# EAGLE design H2BR0-6 (EAGLE 9.6.1)

## Sheet 1 of 2
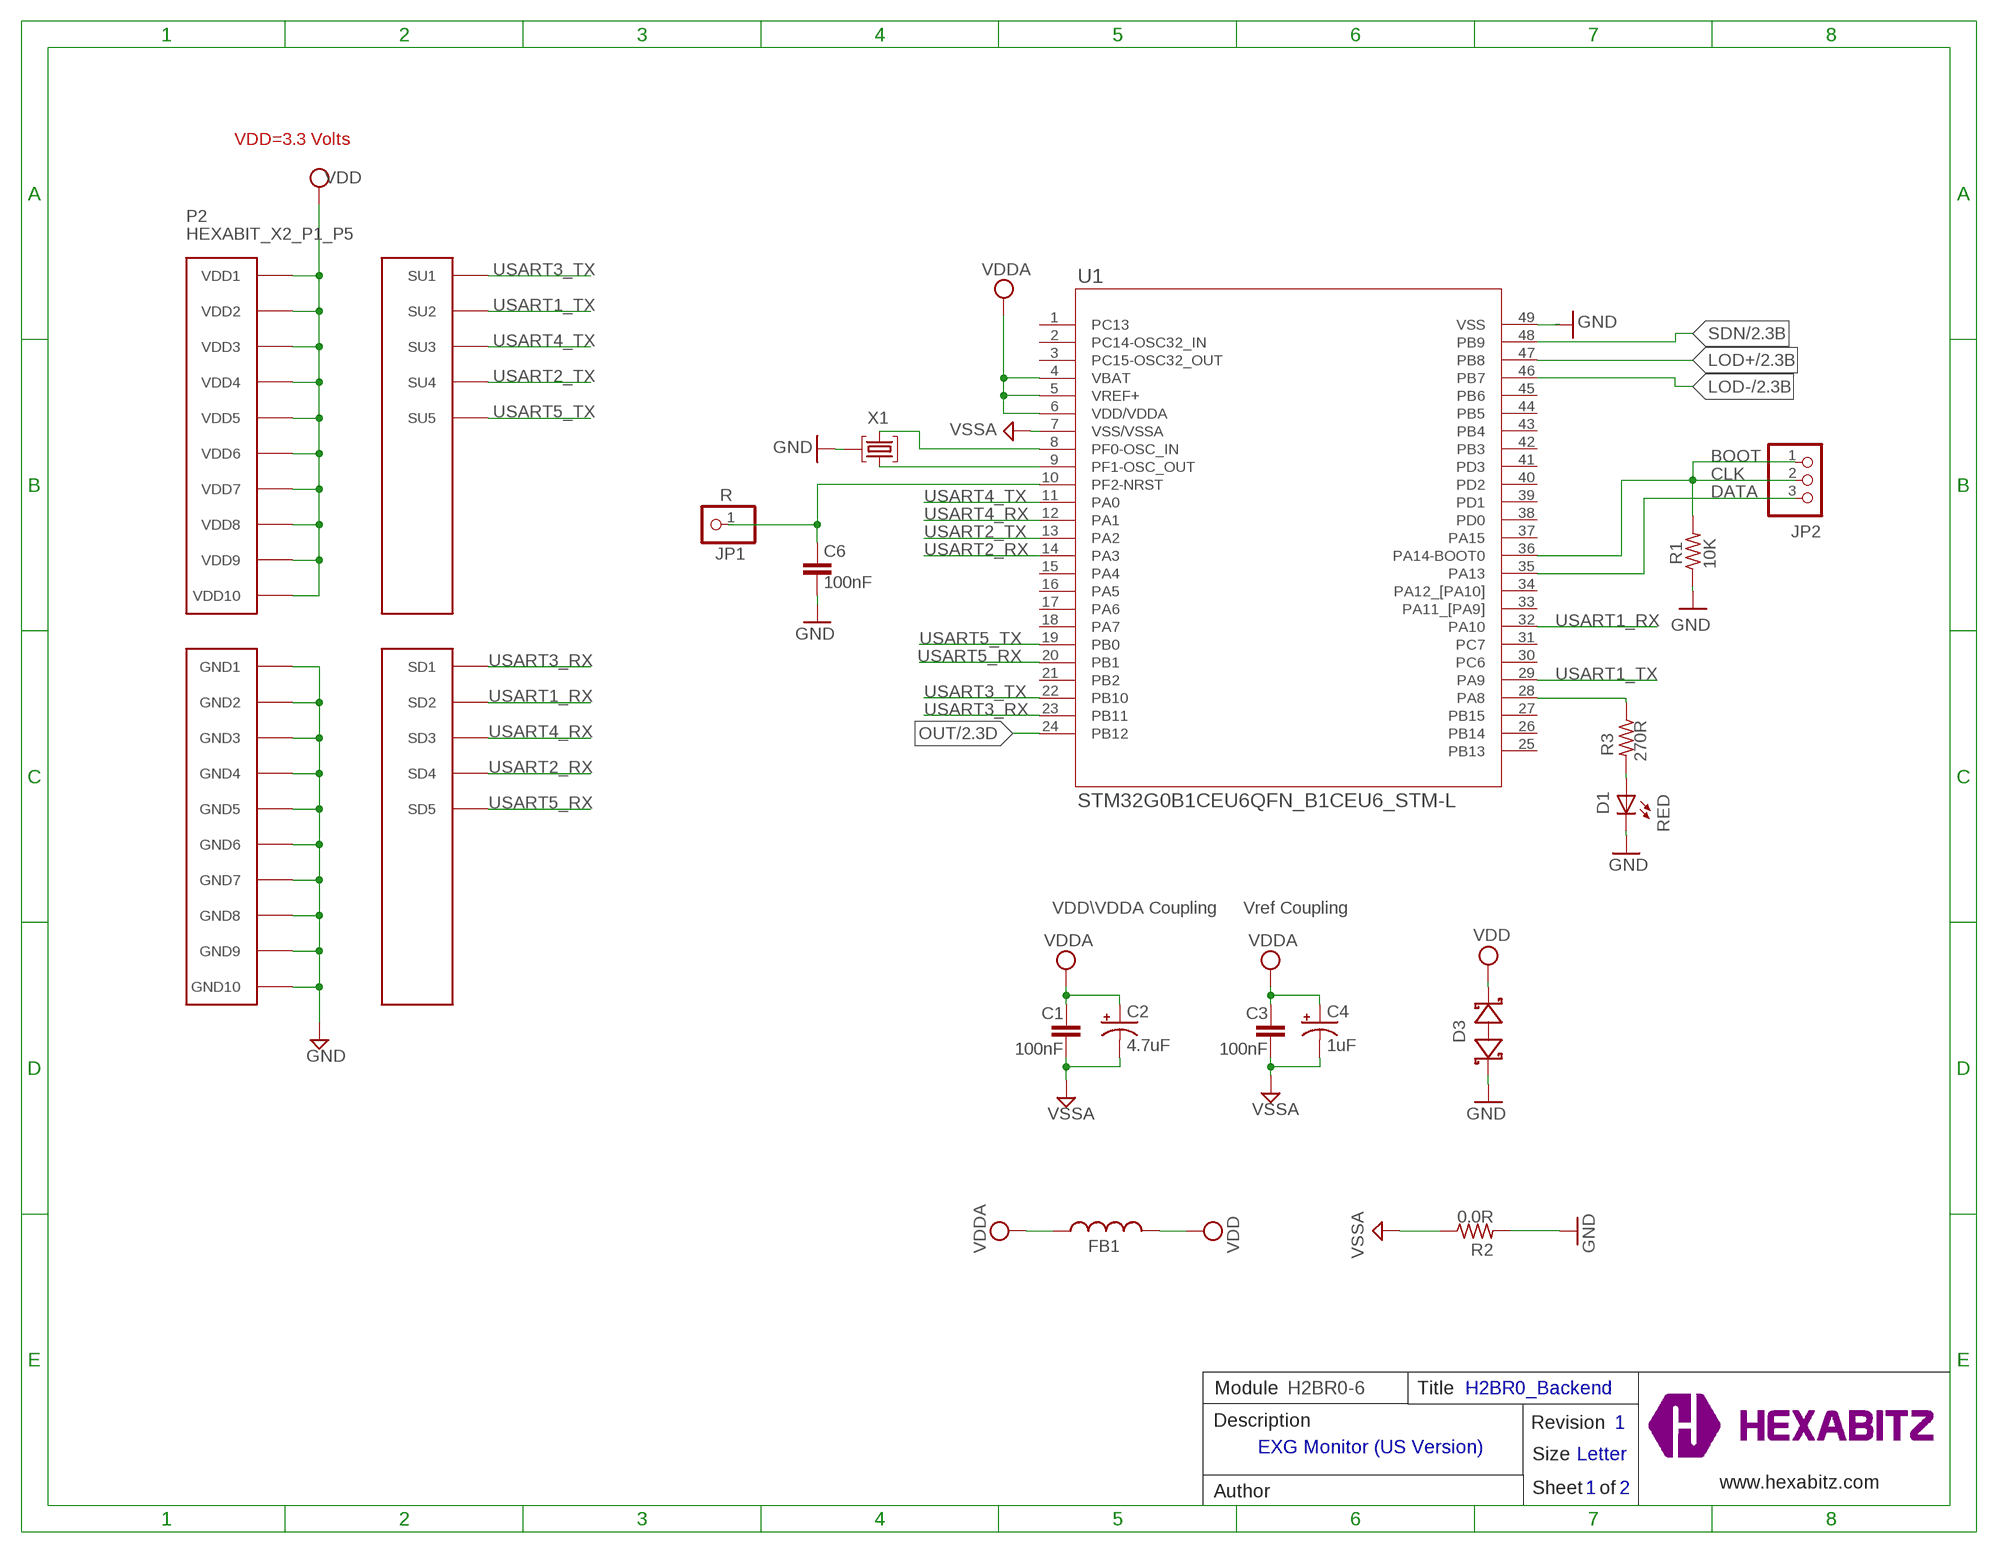
[diagram p0: schematic, sheet 1]

### Parts
C1  100nF  C-0603  [C-0603]
C2  4.7uF  C-0805-POL  [C-0805-POL]
C3  100nF  C-0603  [C-0603]
C4  1uF  C-0805-POL  [C-0805-POL]
C6  100nF  C-0603  [C-0603]
D1  RED  VLMS1300-GS08  [VLMS1300-GS08]
D3  BOURNS_CDSOD323-T03SCBOURNS_CDSOD323-T03SC_0_0  [BOURNS_CDSOD323-T03SC_0]
FB1  FB-0603  [FB-0603]
JP1  R  PINHD-1X1  [1X01]
JP2  PINHD-1X3  [1X03]
P2  HEXABIT_X2_P1_P5  [HEXABIT_17.32_X2_P1_P5]
R1  10K  R-0603  [R-0603]
R2  0.0R  R-0603  [R-0603]
R3  270R  R-0603  [R-0603]
TRIMBLE-LOGO2  HEXA-LOGO  [HEXA-LOGO]
U1  STM32G0B1CEU6QFN_B1CEU6_STM-L  [QFN_B1CEU6_STM-L]
X1  XTALL_CSTCE8M00G52  [XTALL_CSTCE8M00G52]

### Nets
CLK: JP2.1 JP2.2 R1.2 U1.36(PA14-BOOT0)
DATA: JP2.3 U1.35(PA13)
GND: C6.2 D1.C D3.1(A) P2.PAD_PD11(GND1) P2.PAD_PD12(GND2) P2.PAD_PD13(GND3) P2.PAD_PD14(GND4) P2.PAD_PD15(GND5) P2.PAD_PD16(GND6) P2.PAD_PD17(GND7) P2.PAD_PD18(GND8) P2.PAD_PD19(GND9) P2.PAD_PD20(GND10) R1.1 R2.2 U1.49(VSS) X1.P$2
LOD+: U1.47(PB8) ; also sheet 2
LOD-: U1.46(PB7) ; also sheet 2
N$1: D1.A R3.2
N$2: R3.1 U1.28(PA8)
N$5: U1.9(PF1-OSC_OUT) X1.P$1
N$6: U1.8(PF0-OSC_IN) X1.P$3
N$8: C6.1 JP1.1 U1.10(PF2-NRST)
OUT: U1.24(PB12) ; also sheet 2
SDN: U1.48(PB9) ; also sheet 2
USART1_RX: P2.PAD_PD2(SD2) U1.32(PA10)
USART1_TX: P2.PAD_PU2(SU2) U1.29(PA9)
USART2_RX: P2.PAD_PD4(SD4) U1.14(PA3)
USART2_TX: P2.PAD_PU4(SU4) U1.13(PA2)
USART3_RX: P2.PAD_PD1(SD1) U1.23(PB11)
USART3_TX: P2.PAD_PU1(SU1) U1.22(PB10)
USART4_RX: P2.PAD_PD3(SD3) U1.12(PA1)
USART4_TX: P2.PAD_PU3(SU3) U1.11(PA0)
USART5_RX: P2.PAD_PD5(SD5) U1.20(PB1)
USART5_TX: P2.PAD_PU5(SU5) U1.19(PB0)
VDD: D3.2(C) FB1.2 P2.PAD_PU11(VDD1) P2.PAD_PU12(VDD2) P2.PAD_PU13(VDD3) P2.PAD_PU14(VDD4) P2.PAD_PU15(VDD5) P2.PAD_PU16(VDD6) P2.PAD_PU17(VDD7) P2.PAD_PU18(VDD8) P2.PAD_PU19(VDD9) P2.PAD_PU20(VDD10) ; also sheet 2
VDDA: C1.1 C2.1(+) C3.1 C4.1(+) FB1.1 U1.4(VBAT) U1.5(VREF+) U1.6(VDD/VDDA) ; also sheet 2
VSSA: C1.2 C2.2(-) C3.2 C4.2(-) R2.1 U1.7(VSS/VSSA) ; also sheet 2
Unconnected: U1.1(PC13) U1.2(PC14-OSC32_IN) U1.3(PC15-OSC32_OUT) U1.15(PA4) U1.16(PA5) U1.17(PA6) U1.18(PA7) U1.21(PB2) U1.25(PB13) U1.26(PB14) U1.27(PB15) U1.30(PC6) U1.31(PC7) U1.33(PA11_[PA9]) U1.34(PA12_[PA10]) U1.37(PA15) U1.38(PD0) U1.39(PD1) U1.40(PD2) U1.41(PD3) U1.42(PB3) U1.43(PB4) U1.44(PB5) U1.45(PB6)

### Notes on the sheet
- VDD=3.3 Volts
- BOOT
- VDD\VDDA Coupling | Vref Coupling
- Module | H2BR0-6 | Title | H2BR0_Backend
- Description | Revision | 1
- EXG Monitor (US Version)
- Size | Letter
- www.hexabitz.com
- Author | Sheet   of | 1 | 2
- C:/Users/Admin/Desktop/logodraft.bmp

## Sheet 2 of 2
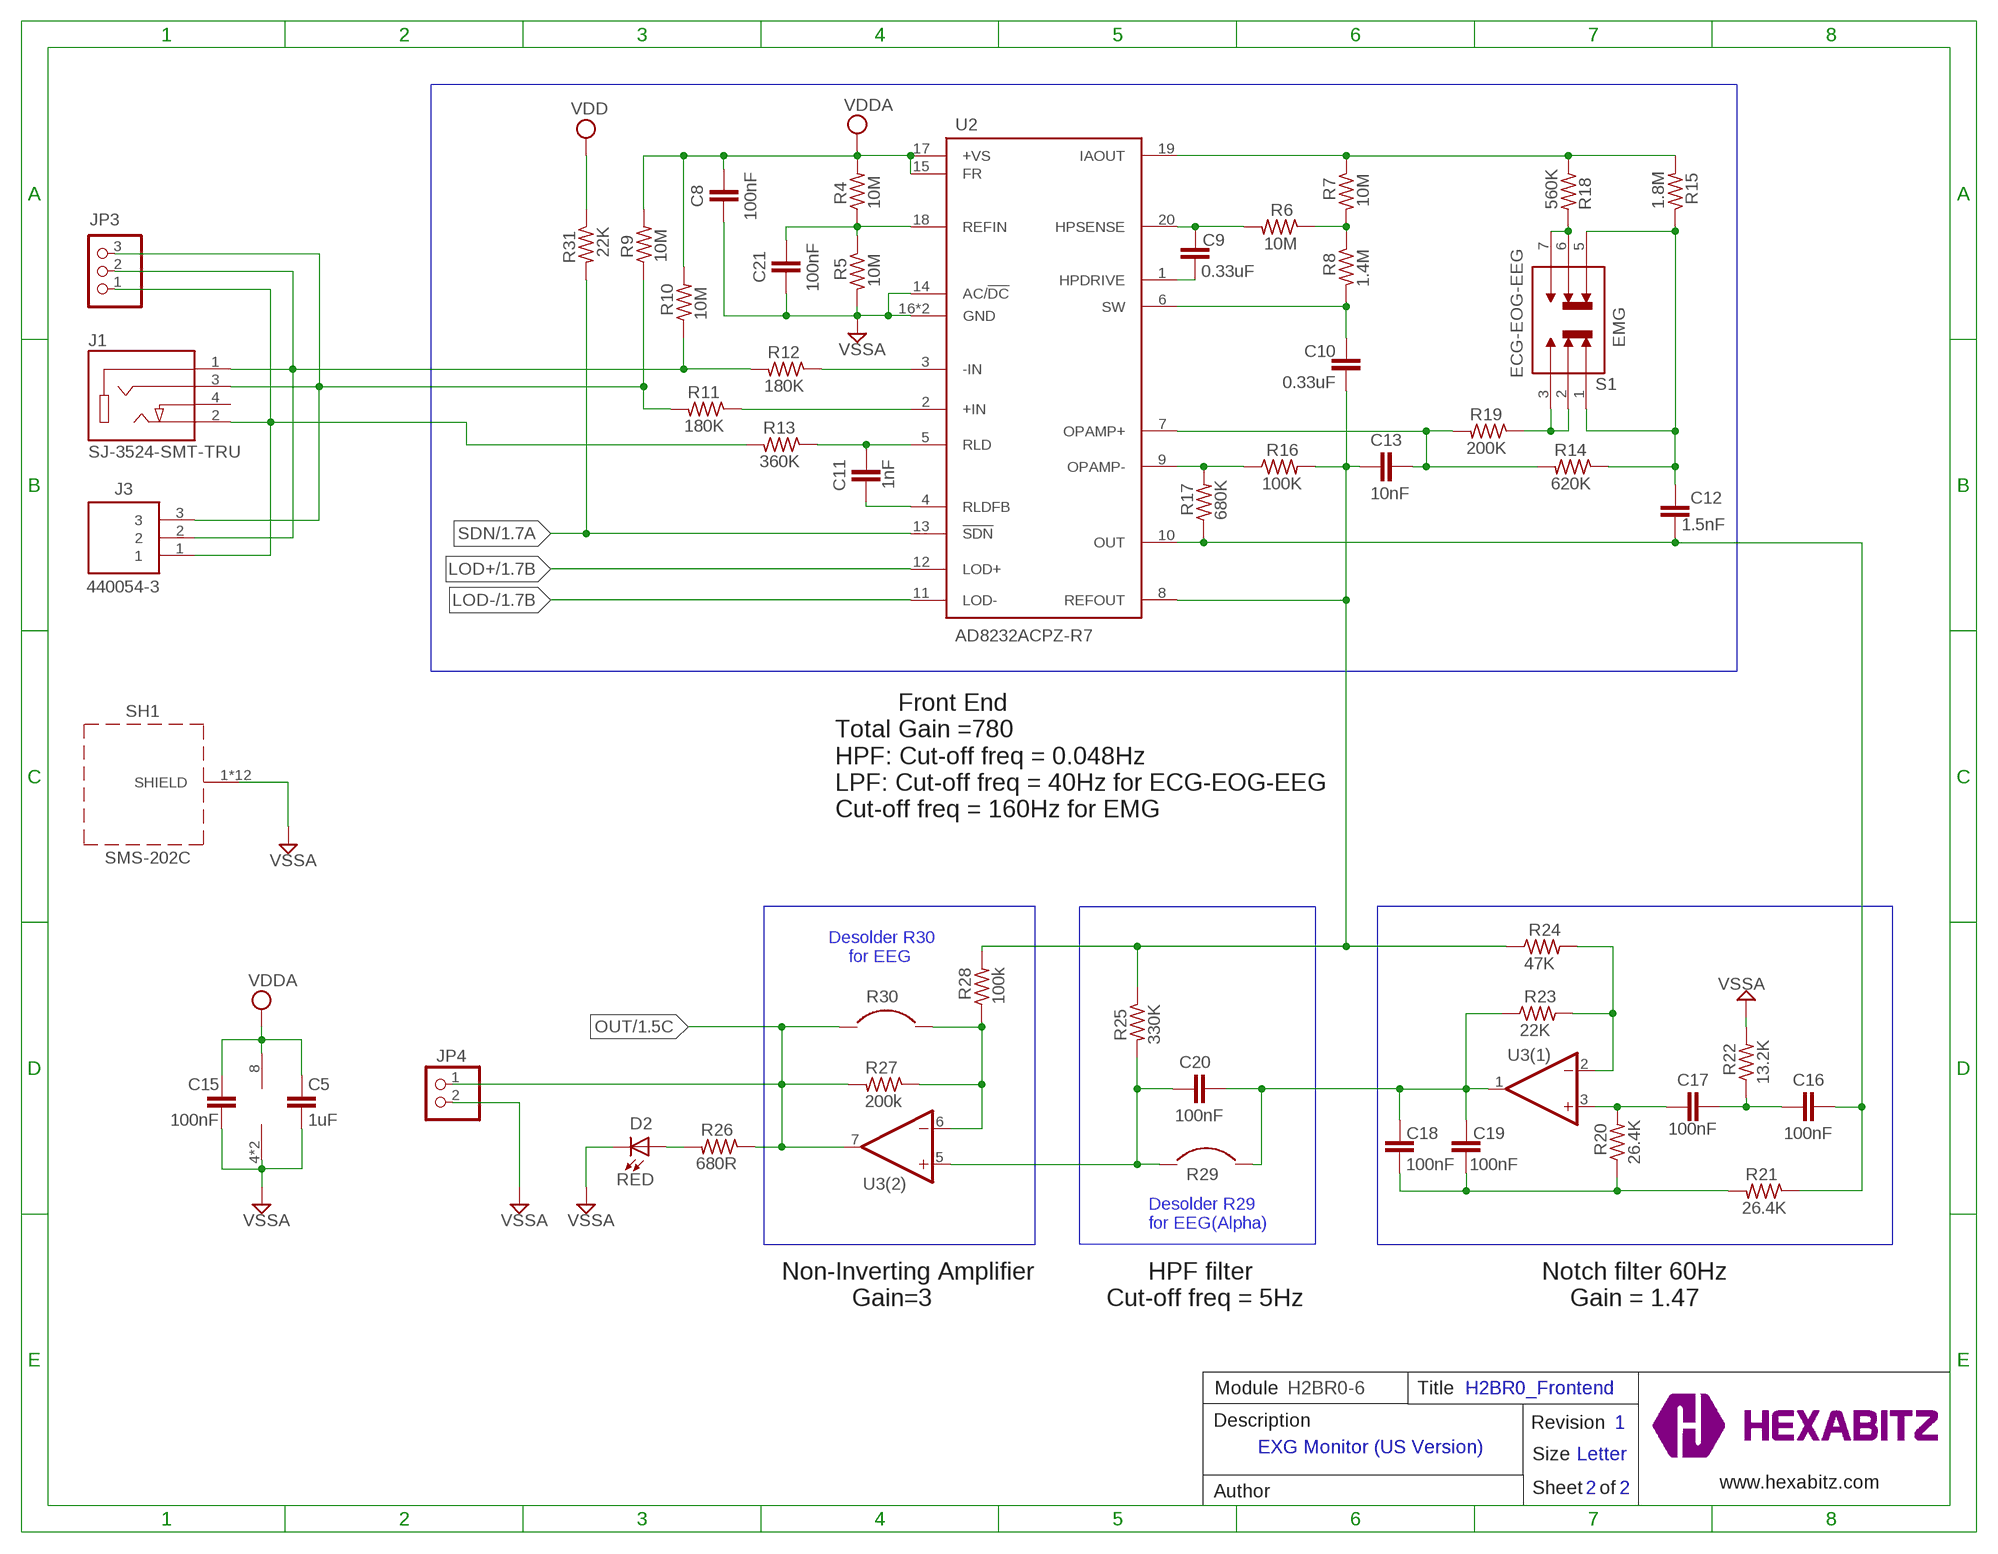
[diagram p1: schematic, sheet 2]

### Parts
C5  1uF  C-0402  [C-0402]
C8  100nF  C-0402  [C-0402]
C9  0.33uF  C-0402  [C-0402]
C10  0.33uF  C-0402  [C-0402]
C11  1nF  C-0402  [C-0402]
C12  1.5nF  C-0402  [C-0402]
C13  10nF  C-0402  [C-0402]
C15  100nF  C-0402  [C-0402]
C16  100nF  C-0402  [C-0402]
C17  100nF  C-0402  [C-0402]
C18  100nF  C-0402  [C-0402]
C19  100nF  C-0402  [C-0402]
C20  100nF  C-0402  [C-0402]
C21  100nF  C-0402  [C-0402]
D2  RED  VLMS1300-GS08  [VLMS1300-GS08]
J1  SJ-3524-SMT-TRU  [CUI_SJ-3524-SMT]
J3  440054-3  [SHDR3W50P0X200_1X3_800X470X635]
JP3  PINHD-1X3  [1X03]
JP4  PINHD-1X2(ROUND)  [1X02]
R4  10M  R-0402  [R-0402]
R5  10M  R-0402  [R-0402]
R6  10M  R-0402  [R-0402]
R7  10M  R-0402  [R-0402]
R8  1.4M  R-0402  [R-0402]
R9  10M  R-0402  [R-0402]
R10  10M  R-0402  [R-0402]
R11  180K  R-0402  [R-0402]
R12  180K  R-0402  [R-0402]
R13  360K  R-0402  [R-0402]
R14  620K  R-0402  [R-0402]
R15  1.8M  R-0402  [R-0402]
R16  100K  R-0402  [R-0402]
R17  680K  R-0402  [R-0402]
R18  560K  R-0402  [R-0402]
R19  200K  R-0402  [R-0402]
R20  26.4K  R-0402  [R-0402]
R21  26.4K  R-0402  [R-0402]
R22  13.2K  R-0402  [R-0402]
R23  22K  R-0402  [R-0402]
R24  47K  R-0402  [R-0402]
R25  330K  R-0402  [R-0402]
R26  680R  R-0603  [R-0603]
R27  200k  R-0402  [R-0402]
R28  100k  R-0402  [R-0402]
R29  SB-0603  [SB-0603]
R30  SB-0603  [SB-0603]
R31  22K  R-0402  [R-0402]
S1  JS202011JCQN  [SW_JS202011JCQN]
SH1  SMS-202C  [SMS202F]
U2  AD8232ACPZ-R7  [QFN50P400X400X80-21N]
U3  TSV772IQ2T_SEPARATED_SYMBOLSSON50P200X200X60-9N  [SON50P200X200X60-9N]

### Nets
IN+: J1.3 J3.3 JP3.3 R9.1 R11.2
IN-: J1.1 J3.2 JP3.2 R10.1 R12.2
LOD+: U2.12(LOD+) ; also sheet 1
LOD-: U2.11(LOD-) ; also sheet 1
N$3: R16.1 R17.2 U2.9(OPAMP-)
N$4: C12.1 C16.2 R17.1 R21.1 U2.10(OUT)
N$7: C13.1 R14.2 R19.2 U2.7(OPAMP+)
N$9: R27.1 R28.1 R30.2 U3.6((2):-IN)
N$10: R19.1 S1.2 S1.3
N$11: R18.2 S1.6 S1.7
N$12: C12.2 R14.1 R15.1 S1.1 S1.5
N$13: R7.1 R15.2 R18.1 U2.19(IAOUT)
N$14: C9.1 R6.2 U2.20(HPSENSE)
N$15: C9.2 U2.1(HPDRIVE)
N$16: R6.1 R7.2 R8.1
N$17: R23.2 R24.2 U3.2((1):-IN)
N$18: C21.1 R4.1 R5.1 U2.18(REFIN)
N$19: C18.1 C19.1 R20.1 R21.2
N$20: C11.1 R13.1 U2.5(RLD)
N$21: C17.1 R20.2 U3.3((1):+IN)
N$22: C18.2 C19.2 C20.2 R23.1 R29.2 U3.1((1):OUT)
N$23: C16.1 C17.2 R22.1
N$24: C20.1 R25.2 R29.1 U3.5((2):+IN)
N$25: C10.2 C13.2 R16.2 R24.1 R25.1 R28.2 U2.8(REFOUT)
N$26: C10.1 R8.2 U2.6(SW)
N$27: D2.A R26.2
N$29: C11.2 U2.4(RLDFB)
N$30: R12.1 U2.3(-IN)
N$31: R11.1 U2.2(+IN)
OUT: JP4.1 R26.1 R27.2 R30.1 U3.7((2):OUT) ; also sheet 1
REF: J1.2 J3.1 JP3.1 R13.2
SDN: R31.2 U2.13(!SDN) ; also sheet 1
VDD: R31.1 ; also sheet 1
VDDA: C5.1 C8.1 C15.1 R4.2 R9.2 R10.2 U2.15(FR) U2.17(+VS) U3.8(P:V+) ; also sheet 1
VSSA: C5.2 C8.2 C15.2 C21.2 D2.C JP4.2 R5.2 R22.2 SH1.1(SHIELD) SH1.2(SHIELD) SH1.3(SHIELD) SH1.4(SHIELD) SH1.5(SHIELD) SH1.6(SHIELD) SH1.7(SHIELD) SH1.8(SHIELD) SH1.9(SHIELD) SH1.10(SHIELD) SH1.11(SHIELD) SH1.12(SHIELD) U2.14(AC/!DC) U2.16(GND) U2.21(GND) U3.4(P:V-) U3.9(P:V-) ; also sheet 1
Unconnected: J1.4

### Notes on the sheet
- EMG
- ECG-EOG-EEG
- Front End
  Total Gain =780
  HPF: Cut-off freq = 0.048Hz
  LPF: Cut-off freq = 40Hz for ECG-EOG-EEG 
  Cut-off freq = 160Hz for EMG
- Desolder R30
      for EEG
- Desolder R29 
  for EEG(Alpha)
- Non-Inverting Amplifier
            Gain=3
- HPF filter
  Cut-off freq = 5Hz
- Notch filter 60Hz
      Gain = 1.47
- Module | H2BR0-6 | Title | H2BR0_Frontend
- Description | Revision | 1
- EXG Monitor (US Version)
- Size | Letter
- www.hexabitz.com
- Author | Sheet   of | 2 | 2
- C:/Users/Admin/Desktop/logodraft.bmp

## Library data of the parts
C1 C3 C6 = HEXABITZ_RCLS:C-0603: CAP CER 10% X7R 0603
C2 C4 = HEXABITZ_RCLS:C-0805-POL: Cap Tant Solid SMD 2012
C5 C8-C13 C15-C19 C21 = HEXABITZ_RCLS:C-0402: CAP CER 10% 0402
C20 = HEXABITZ_RCLS:C-0402: CAP CER 10% 0402; MPN: GRM188R61A105KA61J
D1 D2 = Hexabitz:VLMS1300-GS08: Red 0603 130° Clear 54 mcd 2 V Surface Mount ChipLED ; Octopart Url : http://octopart.com/vlms1300-gs08-vishay-21709201; MFN: Vishay; MPN: VLMS1300-GS08; OCTOPART_URL: https://octopart.com/vlms1300-gs08-vishay-21709201?r=sp&s=_gcP4_q8T1SC6PJQPTQ9yA
D3 = HEXABITZ_RCLS:BOURNS_CDSOD323-T03SC: CDSOD323-TxxSC - TVS Diode Series; DESCRIPTION: Dio Tvs Vwm 03V 500W Bidir Sod323 / Tape & Reel - 7" Reel; MFN: Bourns; MPN: CDSOD323-T03SC; OCTOPART_URL: https://octopart.com/cdsod323-t03sc-bourns-10487153?r=sp
FB1 = HEXABITZ_RCLS:FB-0603: Ferrite Beads Multi-Layer 0603
J1 = HEXABITZ_ICs:SJ-3524-SMT-TR: https://octopart.com/search?q=SJ-3524-SMT-TR&currency=USD&specs=0; AVAILABILITY: In Stock; DESCRIPTION: CONN JACK STEREO 3.5MM SMD R/A; MNF: CUI Devices; MPN: SJ-3524-SMT-TR; OCTOPART_URL: https://octopart.com/search?q=SJ-3524-SMT-TR&currency=USD&specs=0; PRICE: 1.03
J3 = HEXABITZ_CONNECTION_PARTS:440054-3: Body Features: Primary Product Color Natural | Configuration Features: Number of Positions 3 | Number of Rows 1 | PCB Mount Orientation Vertical | Contact Features: PCB Contact Termination Area Plating Material Tin | Contact Mating Area Plating Material Thickness 2.032 MICM | Contact Type Pin | Contact Current Rating (Max) 3 AMP | Contact Mating Area Plating Material Finish Bright | Mating Square Post Dimension .5 MM | Contact Mating Area Plating Material Thickness 80 MICIN | Contact Base Material Brass | M Source: Datasheet <https://www.te.com/commerce/DocumentDelivery/DDEController?Action=srchrtrv&DocNm=1-1773713-2_HPI_QRG_EN&DocType=Data Sheet&DocLang=English&PartCntxt=440054-3&DocFormat=pdf>; ARROW_PART_NUMBER: 440054-3; ARROW_PRICE-STOCK: https://www.arrow.com/en/products/440054-3/te-connectivity?region=nac; DESCRIPTION: Body Features: Primary Product Color Natural | Configuration Features: Number of Positions 3 | Number of Rows 1 | PCB Mount Orientation Vertical | Contact Features: PCB Contact Termination Area Plating Material Tin | Contact Mating Area Plating Material Thickness 2.032 MICM | Contact Type Pin | Contact Current Rating (Max) 3 AMP | Contact Mating Area Plating Material Finish Bright | Mating Square Post Dimension .5 MM | Contact Mating Area Plating Material Thickness 80 MICIN | Contact Base Material Brass | M; HEIGHT: 6.35mm; MANUFACTURER_NAME: TE Connectivity; MANUFACTURER_PART_NUMBER: 440054-3; MOUSER_PART_NUMBER: 571-440054-3; MOUSER_PRICE-STOCK: https://www.mouser.co.uk/ProductDetail/TE-Connectivity/440054-3?qs=JFPmFzpscO5ATC%252BmN3ka1Q%3D%3D
JP1 = HEXABITZ_USER_INTERFACE_PARTS:PINHD-1X1: PIN HEADER; MFN: TE Connectivity; MPN: 87227-1; OCTOPART_URL: https://octopart.com/87227-1-te+connectivity-39512052?r=sp
JP2 JP3 = pinhead:PINHD-1X3: PIN HEADER
JP4 = pinhead:PINHD-1X2(ROUND): PIN HEADER
P2 = hexabitz_connectors:HEXABIT_X2_P1_P5
R1-R3 R26 = HEXABITZ_RCLS:R-0603: Thick Film Resistors - SMD 0603
R4-R25 R27 R28 R31 = HEXABITZ_RCLS:R-0402: Thick Film Resistors - SMD 0603
R29 R30 = HEXABITZ_RCLS:SB-0603: Thick Film Resistors - SMD 0603
S1 = HEXABITZ_OTHER_PARTS:JS202011JCQN: Slide Switch DPDT Surface Mount Check availability <https://pricing.snapeda.com/parts/JS202011JCQN/C%26K/view-part?ref=eda>; AVAILABILITY: In Stock; CHECK_PRICES: https://www.snapeda.com/parts/JS202011JCQN/C%2526K/view-part/?ref=eda; DESCRIPTION: Slide Switch DPDT Surface Mount; MF: C&K; MP: JS202011JCQN; PACKAGE: DPDT-6 C&amp;K; PRICE: None; SNAPEDA_LINK: https://www.snapeda.com/parts/JS202011JCQN/C%2526K/view-part/?ref=snap
SH1 = HEXABITZ_OTHER_PARTS:SMS-202C: LEADER TECH-FERRISHIELD - SMS-202C - EMI SHIELDING, 17.07 X 17.07 X 2.01MM Source: Datasheet <https://www.leadertechinc.com/assets/files/EngineeringDrawings/SMS-202.pdf>; DESCRIPTION: LEADER TECH-FERRISHIELD - SMS-202C - EMI SHIELDING, 17.07 X 17.07 X 2.01MM; HEIGHT: 3.61mm; MANUFACTURER_NAME: Leader Tech Inc.; MANUFACTURER_PART_NUMBER: SMS-202C; MOUSER_PART_NUMBER: 861-SMS-202C; MOUSER_PRICE-STOCK: https://www.mouser.co.uk/ProductDetail/LeaderTech/SMS-202C?qs=u16ybLDytRYoSSFRGBpM2A%3D%3D
TRIMBLE-LOGO2 = HEXABITZ_USER_INTERFACE_PARTS:HEXA-LOGO: Trimble-Logo
U1 = HEXABITZ_ICs:STM32G0B1CEU6; COPYRIGHT: Copyright (C) 2021 Ultra Librarian. All rights reserved.; MANUFACTURER_PART_NUMBER: STM32G0B1CEU6; MFR_NAME: STMicroelectronics
U2 = HEXABITZ_ICs:AD8232ACPZ-R7: ANALOG DEVICES - AD8232ACPZ-R7 - SIGNAL CONDITIONER, ECG, LFCSP-20 Source: Datasheet <https://www.analog.com/media/jp/technical-documentation/data-sheets/AD8232_jp.pdf>; ARROW_PART_NUMBER: AD8232ACPZ-R7; ARROW_PRICE-STOCK: https://www.arrow.com/en/products/ad8232acpz-r7/analog-devices?region=nac; DESCRIPTION: ANALOG DEVICES - AD8232ACPZ-R7 - SIGNAL CONDITIONER, ECG, LFCSP-20; HEIGHT: 0.8mm; MANUFACTURER_NAME: Analog Devices; MANUFACTURER_PART_NUMBER: AD8232ACPZ-R7; MOUSER_PART_NUMBER: 584-AD8232ACPZ-R7; MOUSER_PRICE-STOCK: https://www.mouser.co.uk/ProductDetail/Analog-Devices/AD8232ACPZ-R7?qs=%2FtpEQrCGXCwf%2FvQng%2FSFzg%3D%3D
U3 = HEXABITZ_ICs:TSV772IQ2T_SEPARATED_SYMBOLS: OP AMP also LM158; LM258; LM2904 Source: http://cache.national.com/ds/LM/LM158.pdf
X1 = Hexabitz:XTALL_CSTCE8M00G52: MURATA CSTCE8M00G52-R0 RESONATOR, SMD, 8MHZ ; Octopart Url : https://octopart.com/cstce8m00g52-r0-murata-7145559; MFN: Murata; MPN: CSTCE8M00G52Z-R0; OCTOPART_URL: https://octopart.com/cstce8m00g52z-r0-murata-17755941?r=sp&s=JDnNJnrHQhyS8Zk4ofFWXw

## Board
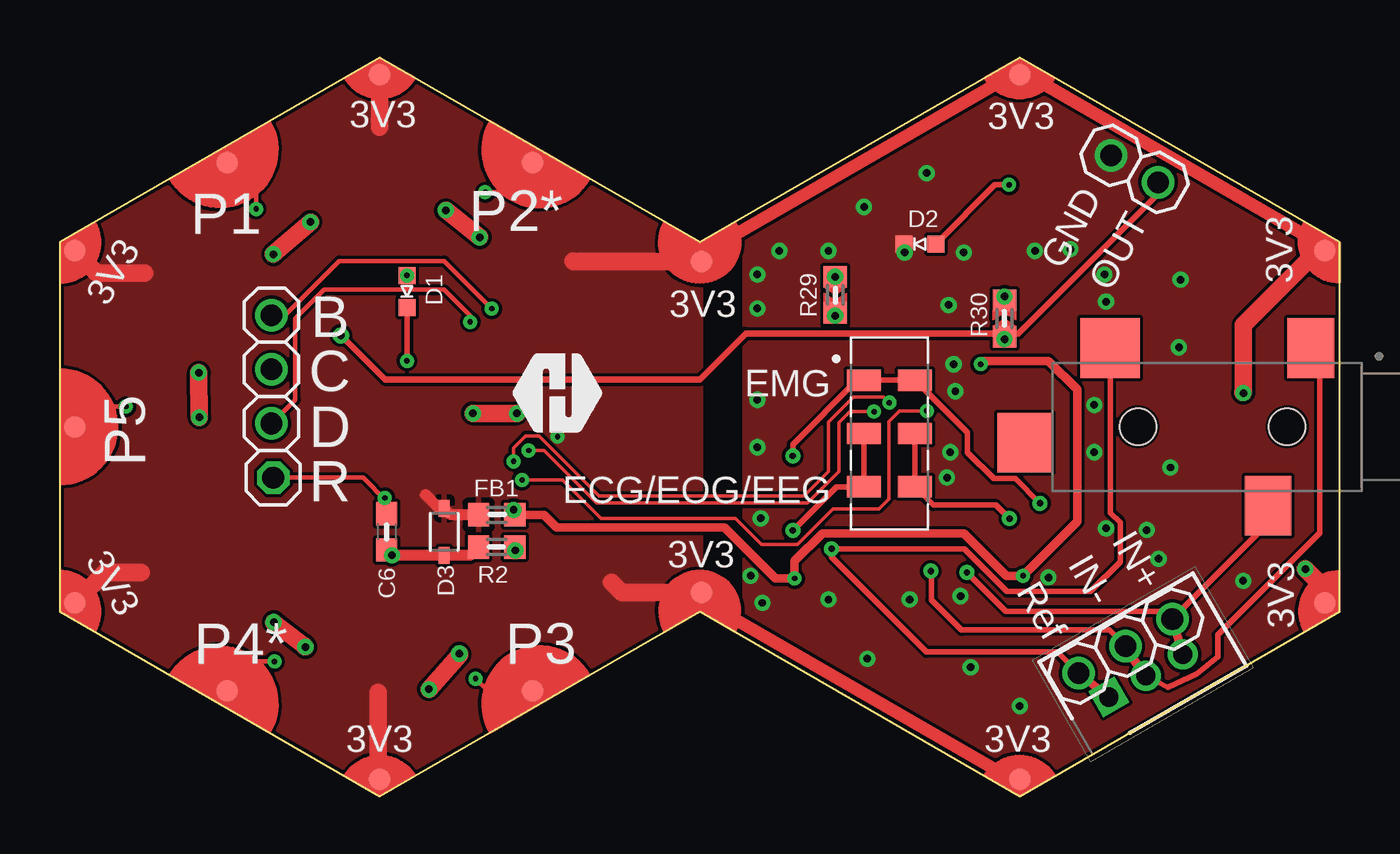
[diagram p2: board, top side]
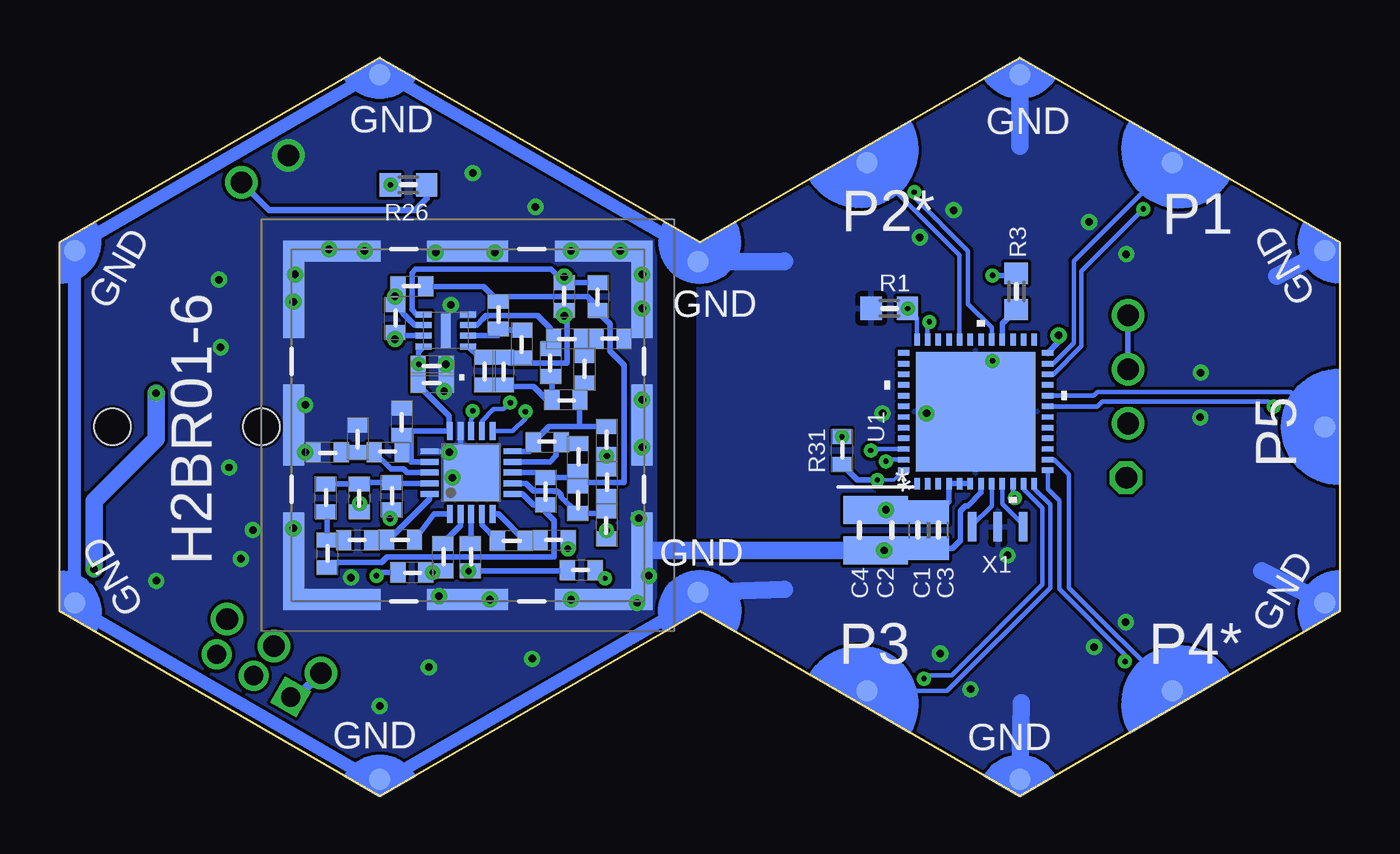
[diagram p3: board, bottom side, seen from below]

Size 60 x 34.64 mm. Coordinates in mm from the lower left corner, seen from the top.
Copper layers (1*16): Top 0.035mm / dielectric 1.5mm / Bottom 0.035mm
Design rules "default *": minimum track width 6mil, minimum drill 0.25mm, track to track 6mil, track to pad 6mil, pad to pad 6mil, via to via 6mil, smd to smd 0mil, copper to edge 0.15mm, drill to drill 6mil, minimum pad ring 10mil, minimum via ring 8mil, stop-mask expansion 4mil, vias tented up to drill 24mil, thermal gap 10mil

### Footprints (pad centres in the part's own frame; a part is rotated, then mirrored left to right if it is on the bottom)
C-0603 = smd 1.1 x 1: 1 -0.85,0; 2 0.85,0
C-0805-POL = smd 1.3 x 1.5: 1 -0.95,0; 2 0.95,0
C-0402 = smd 0.7 x 0.9: 1 -0.65,0; 2 0.65,0
VLMS1300-GS08 = smd 0.8 x 0.8: A 0,0.75; C 0,-0.75
BOURNS_CDSOD323-T03SC_0 = smd 0.8 x 0.5: 1 -1.1,0; 2 1.1,0
FB-0603 = smd 1 x 1.1: 1 -0.85,0; 2 0.85,0
CUI_SJ-3524-SMT = smd 2.2 x 2.8: 1 -1.1,-3.7; 3 0.9,3.7 | smd 2.8 x 2.8: 2 8.3,-3.7 | smd 2.6 x 2.8: 4 12.3,0.75 | hole 1.7: 0,0; 7,0
SHDR3W50P0X200_1X3_800X470X635 = drill 0.9 pad 1.35 square: 1 0,0 | drill 0.9 pad 1.35: 2 2,0; 3 4,0
1X01 = drill 1.016 octagon: 1 0,0
1X03 = drill 1.016: 1 -2.54,0; 2 0,0; 3 2.54,0
1X02 = drill 1.016: 1 -1.27,0; 2 1.27,0
HEXABIT_17.32_X2_P1_P5 = smd 1 x 1 bottom: PAD_PD1 12.39,22.39; PAD_PD2 12.39,8.09; PAD_PD3 -12.39,8.09; PAD_PD4 -12.39,22.39; PAD_PD5 0,29.55; PAD_PD12 16.52,15.24; PAD_PD13 7.752,0.168; PAD_PD14 16.52,-14.76; PAD_PD15 8.26,-29.07; PAD_PD16 -8.26,-29.07; PAD_PD17 -16.52,-14.76; PAD_PD18 -7.752,0.168; PAD_PD19 -16.52,15.24 | smd 1 x 1 rotated 60 bottom: PAD_PD11 8.26,29.547 | smd 1 x 1 rotated 120 bottom: PAD_PD20 -8.26,29.547 | smd 1 x 1: PAD_PU1 12.39,22.39; PAD_PU2 12.39,8.09; PAD_PU3 -12.39,8.09; PAD_PU4 -12.39,22.39; PAD_PU5 0,29.55; PAD_PU12 16.52,15.24; PAD_PU13 7.752,0.168; PAD_PU14 16.52,-14.76; PAD_PU15 8.26,-29.07; PAD_PU16 -8.26,-29.07; PAD_PU17 -16.52,-14.76; PAD_PU18 -7.752,0.168; PAD_PU19 -16.52,15.24 | smd 1 x 1 rotated 60: PAD_PU11 8.26,29.547 | smd 1 x 1 rotated 120: PAD_PU20 -8.26,29.547
R-0603 = smd 1 x 1.1: 1 -0.85,0; 2 0.85,0
R-0402 = smd 0.7 x 0.9: 1 -0.65,0; 2 0.65,0
SB-0603 = smd 1 x 1.1: 1 -0.85,0; 2 0.85,0
SW_JS202011JCQN = smd 1.6 x 1: 1 -1.2,2.5; 2 -1.2,0; 3 -1.2,-2.5; 5 1.2,2.5; 6 1.2,0; 7 1.2,-2.5
SMS202F = smd 0.99 x 3.58: 1 -8.165,5.88; 3 -8.165,-5.88; 7 8.165,-5.88; 9 8.165,5.88 | smd 0.99 x 3.81: 2 -8.165,0.01; 8 8.165,0.01 | smd 4.57 x 0.99: 4 -6.375,-8.165; 6 6.375,-8.165; 10 6.375,8.165; 12 -6.375,8.165 | smd 3.81 x 0.99: 5 -0.01,-8.165; 11 -0.01,8.165
QFN_B1CEU6_STM-L = smd 0.55 x 0.254: 1 -3.38,2.751; 2 -3.38,2.251; 3 -3.38,1.75; 4 -3.38,1.25; 5 -3.38,0.75; 6 -3.38,0.25; 7 -3.38,-0.25; 8 -3.38,-0.75; 9 -3.38,-1.25; 10 -3.38,-1.75; 11 -3.38,-2.251; 12 -3.38,-2.751; 25 3.38,-2.751; 26 3.38,-2.251; 27 3.38,-1.75; 28 3.38,-1.25; 29 3.38,-0.75; 30 3.38,-0.25; 31 3.38,0.25; 32 3.38,0.75; 33 3.38,1.25; 34 3.38,1.75; 35 3.38,2.251; 36 3.38,2.751 | smd 0.254 x 0.55: 13 -2.751,-3.38; 14 -2.251,-3.38; 15 -1.75,-3.38; 16 -1.25,-3.38; 17 -0.75,-3.38; 18 -0.25,-3.38; 19 0.25,-3.38; 20 0.75,-3.38; 21 1.25,-3.38; 22 1.75,-3.38; 23 2.251,-3.38; 24 2.751,-3.38; 37 2.751,3.38; 38 2.251,3.38; 39 1.75,3.38; 40 1.25,3.38; 41 0.75,3.38; 42 0.25,3.38; 43 -0.25,3.38; 44 -0.75,3.38; 45 -1.25,3.38; 46 -1.75,3.38; 47 -2.251,3.38; 48 -2.751,3.38 | smd 5.6 x 5.6: 49 0,0
QFN50P400X400X80-21N = smd 0.84 x 0.28: 1 -1.95,1; 2 -1.95,0.5; 3 -1.95,0; 4 -1.95,-0.5; 5 -1.95,-1; 11 1.95,-1; 12 1.95,-0.5; 13 1.95,0; 14 1.95,0.5; 15 1.95,1 | smd 0.28 x 0.84: 6 -1,-1.95; 7 -0.5,-1.95; 8 0,-1.95; 9 0.5,-1.95; 10 1,-1.95; 16 1,1.95; 17 0.5,1.95; 18 0,1.95; 19 -0.5,1.95; 20 -1,1.95 | smd 2.6 x 2.6: 21 0,0
SON50P200X200X60-9N = smd 0.75 x 0.28: 1 -1.05,0.75; 2 -1.05,0.25; 3 -1.05,-0.25; 4 -1.05,-0.75; 5 1.05,-0.75; 6 1.05,-0.25; 7 1.05,0.25; 8 1.05,0.75 | smd 0.45 x 1.6: 9 0,0
XTALL_CSTCE8M00G52 = smd 1.4 x 0.4: P$1 0,1.2; P$2 0,0; P$3 0,-1.2

### Placement (x,y rotation side)
C1  19.76,12.48 270 bottom
C2  21,12.48 270 bottom
C3  18.81,12.48 270 bottom
C4  22.51,12.48 270 bottom
C5  42.54,19.38 0 bottom
C6  15.32,12.4 270 top
C8  43.97,17.56 90 bottom
C9  44.03,12.03 0 bottom
C10  37.22,14.3 90 bottom
C11  38.84,11.98 180 bottom
C12  34.37,16.68 270 bottom
C13  35.72,13.91 90 bottom
C15  42.54,20.18 0 bottom
C16  35.4,20.02 270 bottom
C17  36.19,21.45 0 bottom
C18  40.08,19.94 90 bottom
C19  39.21,19.94 90 bottom
C20  36.35,23.43 270 bottom
C21  46.04,16.76 90 bottom
D1  16.27,23.67 0 top
D2  40.32,25.89 270 top
D3  18.02,12.4 90 top
FB1  20.48,13.19 180 top
J1  57.55,17.32 180 top
J3  49.19,4.65 30 top
JP1  10,14.94 0 top
JP2  9.92,20.02 270 top
JP3  49.96,7.04 30 top
JP4  50.39,29.42 150.2 top
P2  30.24,17.32 90 top
R1  21.11,22.88 0 bottom
R2  20.48,11.68 180 top
R3  15.16,23.67 90 bottom
R4  44.61,16.13 0 bottom
R5  47.46,16.13 180 bottom
R6  46.04,12 0 bottom
R7  47.54,13.99 270 bottom
R8  47.46,11.37 270 bottom
R9  43.5,10.49 180 bottom
R10  35.56,10.59 0 bottom
R11  42.05,11.21 270 bottom
R12  40.76,11.21 270 bottom
R13  36.83,12 0 bottom
R14  34.37,14.7 270 bottom
R15  45.96,13.99 90 bottom
R16  35.72,15.89 270 bottom
R17  37.15,16.61 0 bottom
R18  44.45,14.07 270 bottom
R19  34.37,12.72 90 bottom
R20  36.99,20.34 90 bottom
R21  36.27,18.59 180 bottom
R22  34.21,21.45 0 bottom
R23  38.34,21.21 90 bottom
R24  39.45,22.56 270 bottom
R25  34.76,23.43 90 bottom
R26  43.65,28.67 180 bottom
R27  44.29,22.4 270 bottom
R28  43.5,23.91 0 bottom
R29  36.35,23.51 270 top
R30  44.29,22.4 90 top
R31  23.33,16.21 270 bottom
S1  38.89,17.01 0 top
SH1  40.88,17.4 0 bottom
TRIMBLE-LOGO2  23.33,17.05 0 top
U1  17.06,18.03 90 bottom
U2  40.72,15.18 90 bottom
U3  41.91,21.84 180 bottom
X1  16.03,12.64 270 bottom

### Tracks (layer width: path | path; a pad name or v marks a point on that pad's centre or on a via)
CLK  (via drill 0.25 pad 0.55)
  Top 0.203: JP2.1 10.56,22.56 13.1,25.1 18.02,25.1 v20.25,22.87
  Bottom 0.203: R1.2 v20.25,22.87 19.81,22.43 U1.36
  Bottom 0.254: JP2.1 JP2.2
DATA  (via drill 0.25 pad 0.55)
  Top 0.203: JP2.3 11.03,18.59 11.03,22.4 12.38,23.75 18.02,23.75 19.23,22.53 v19.23,22.24
  Bottom 0.203: v19.23,22.24 19.31,22.16 U1.35
GND  (via drill 0.25 pad 0.55, 0.35 pad 0.75)
  Top 0.254: D1.C v16.27,20.42
  Top 0.305: C6.2 v15.57,11.3
  Top 0.508: R2.2 19.24,11.3 D3.1 v15.57,11.3 | v15.57,11.3
  Top 0.813: v18.73,6.68 18.73,6.62 v17.3,5.02 | v11.51,7 11.43,7.08 v10.03,8.16 | v6.54,17.77 v6.51,19.86 | v10,25.42 v11.75,26.92 | v18.1,27.48 v19.68,26.21 | v19.37,17.96 v21.43,17.96
  Bottom 0.254: v16.27,20.42 16.27,18.83 U1.49
  Bottom 0.61: P2.PAD_PD18 30.94,8.7 44.62,0.8 P2.PAD_PD17 45.38,0.8 58.8,8.55 P2.PAD_PD16 59.31,25.4 58.82,25.89 59,25.89 P2.PAD_PD15 58.8,26.09 45.38,33.84 P2.PAD_PD14 44.62,33.84 30.94,25.94 P2.PAD_PD13
  Bottom 0.813: P2.PAD_PD13 26.03,25.07 26.03,25.1 | P2.PAD_PD12 15,30.5 | P2.PAD_PD11 2.94,24.38 | P2.PAD_PD20 3.65,10.57 | P2.PAD_PD19 14.92,4.38 | P2.PAD_PD18 26.03,9.7 | U1.49 v19.37,17.96
  pour Bottom: 30.08,7.87 30.08,35.18 13.81,35.18 -0.08,35.18 -0.08,4.62 -0.08,-0.06 27.3,-0.06 30.08,-0.06
IN+  (via drill 0.3 pad 0.6)
  Top 0.254: J1.3 56.65,12.79 JP3.3 51.8,8.67 44.35,8.67 v42.53,10.49
  Top 0.406: JP3.3 J3.3
  Bottom 0.305: v42.53,10.49 R9.1 42.11,10.49 R11.2
IN-  (via drill 0.3 pad 0.6)
  Top 0.254: JP3.2 49.2,7.79 42.27,7.79 40.85,9.21 40.85,10.54 v40.84,10.56 | 58.65,20.54 J1.1 59.07,20.6 59.07,12.34 54.29,7.56 54.29,6.53 53.3,5.74 51.95,5.12 J3.2
  Top 0.406: JP3.2 49.93,7.01 50.74,5.83 J3.2
  Bottom 0.254: R10.1 36.24,10.56 R12.2
  Bottom 0.305: R12.2 v40.84,10.56
LOD+  (via drill 0.25 pad 0.55)
  Top 0.152: v21.27,15.7 21.27,16.34 21.83,16.89 22.46,16.89 25.28,14.08 34.88,14.08 36.03,15.23 36.03,17.56 37.2,18.72 38.62,18.72 v38.89,18.45
  Bottom 0.203: U2.12 40.22,17.6 39.67,18.15 39.19,18.15 v38.89,18.45 | U1.47 21.19,15.78 v21.27,15.7
LOD-  (via drill 0.25 pad 0.55)
  Top 0.152: v21.99,16.21 22.7,16.21 25.16,13.75 35.05,13.75 36.54,15.24 36.54,17.54 37.04,18.03 v38.18,18.03
  Bottom 0.203: U2.11 38.77,17.13 38.18,17.72 v38.18,18.03 | v21.99,16.21 21.91,16.28 U1.46
N$1  (via drill 0.25 pad 0.55)
  Bottom 0.254: R3.2 15.26,24.42 D1.A
  other vias: 16.27,24.42
N$2
  Bottom 0.254: R3.1 15.81,22.16 U1.28
N$3
  Bottom 0.254: U2.9 37.03,15.68 36.73,15.97 36.73,16.37 R17.2 36.43,16.54 R16.1
N$4
  Bottom 0.254: U2.10 37.99,16.18 37.8,16.37 R17.1 37.07,17.34 36.03,17.34 | R21.1 35.62,19.15 C16.2 35.64,19.13 35.64,17.34 | 36.03,17.34 | 36.03,17.34 35.64,17.34 | 35.64,17.34 C12.1
N$5
  Bottom 0.203: X1.P$1 14.83,12.72 15.81,13.7 U1.9
N$6
  Bottom 0.203: X1.P$3 17.23,12.7 16.31,13.61 U1.8
N$7
  Bottom 0.254: U2.7 38.14,14.68 37.79,14.32 36.83,14.32 | C13.1 35.72,13.21 | 36.7,14.32 36.83,14.32 | 36.83,14.32 36.79,14.28 36.66,14.28 36.5,14.12 36.5,14.04 C13.1 | C13.1 34.48,13.26 34.38,13.36 | 34.38,13.36 R19.2 | R14.2 34.38,13.36
N$8  (via drill 0.25 pad 0.55)
  Top 0.203: v15.23,13.99 15.32,13.9 15.32,13.83 | 15.32,13.83 C6.1 | JP1.1 14.21,14.94 15.32,13.83
  Bottom 0.203: U1.10 15.31,14.07 v15.23,13.99
N$9  (via drill 0.35 pad 0.75)
  Top 0.254: R30.2 v44.29,23.43
  Bottom 0.254: R27.1 43.9,22.66 43.9,22.63 43.37,22.09 U3.6
  Bottom 0.406: R28.1 44.29,23.76 v44.29,23.43 44.21,23.35 44.21,23.13 R27.1
N$10  (via drill 0.3 pad 0.6)
  Top 0.254: v34.37,12.46 36.41,14.51 S1.3 S1.2
  Bottom 0.254: v34.37,12.46 R19.1
N$11  (via drill 0.3 pad 0.6)
  Top 0.254: S1.6 S1.7 40.95,13.65 43.89,13.65 v44.53,13.02
  Bottom 0.508: v44.53,13.02 44.45,13.1 R18.2
N$12  (via drill 0.3 pad 0.6)
  Top 0.254: v45.96,13.73 44.8,14.89 43.78,14.89 42.54,16.13 42.54,17.06 S1.5 S1.1 37.37,19.51 34.37,16.5 v34.37,15.96
  Bottom 0.254: R14.1 v34.37,15.96 C12.2
  Bottom 0.508: v45.96,13.73 R15.1
N$13
  Bottom 0.254: R7.1 R15.2 45.88,14.72 R18.1 44.41,14.68 U2.19
N$14
  Bottom 0.254: 42.68,14.14 42.67,14.14 U2.20 42.67,13.94 44.58,12.03 C9.1 44.8,12.03 44.83,12 R6.2
N$15
  Bottom 0.254: C9.2 42.45,13.23 U2.1
N$16
  Bottom 0.254: R6.1 47.45,12 R8.1 47.46,13.26 R7.2
N$17
  Bottom 0.254: U3.2 39.45,21.59 R24.2 39.4,21.86 R23.2
N$18
  Bottom 0.254: U2.18 43.71,15.18 43.88,15.35 44.47,15.35 R4.1 45.27,16.11 C21.1 46.8,16.11 R5.1
N$19
  Bottom 0.254: C19.1 39.02,19.48 | C18.1 C19.1 | C19.1 39.13,19.21 37.78,19.21 37.16,18.59 R21.2 | R21.2 36.92,18.82 | R20.1 36.92,19.62 R21.2
N$20
  Bottom 0.254: R13.1 38.05,11.84 C11.1 39.43,13.23 U2.5
N$21
  Bottom 0.254: 36.99,21.59 36.99,21.92 37.6,22.54 40.01,22.54 40.18,22.37 40.45,22.09 U3.3 | 36.99,21.59 C17.1 | R20.2 36.99,21.59
N$22  (via drill 0.35 pad 0.75)
  Top 0.254: v36.35,22.54 R29.2
  Bottom 0.152: C19.2 39.18,20.56 R23.1
  Bottom 0.254: U3.1 40.35,20.59 C18.2 C19.2 38.94,20.32 36.21,20.32 36.21,22.64 C20.2 v36.35,22.54
N$23
  Bottom 0.254: 35.4,20.89 C16.1 34.86,21.21 R22.1 C17.2 35.54,21.04 35.4,20.89
N$24  (via drill 0.35 pad 0.75)
  Bottom 0.254: U3.5 43.28,22.59 43.5,22.81 43.5,24.54 43.33,24.71 36.98,24.71 C20.1 | C20.1 R25.2 | C20.1 R29.1
  other vias: 36.35,24.36
N$25
  Bottom 0.254: 35.55,14.72 35.71,14.72 35.88,14.89 35.88,15.02 | 35.55,14.72 33.55,14.72 33.55,20.22 34.21,20.88 34.21,22.15 34.76,22.7 R25.1 34.76,22.94 35.26,23.43 39.22,23.43 R24.1 40.15,23.91 R28.2 | C13.2 35.55,14.72 | R16.2 35.72,15.18 35.88,15.02 | 35.88,15.02 35.94,14.95 C10.2 37.45,15.18 U2.8
N$26
  Bottom 0.254: U2.6 38.3,14.18 37.78,13.65 C10.1 37.23,13.34 36.83,12.94 36.83,11.23 44.65,11.23 44.92,10.96 47.23,10.96 R8.2
N$27  (via drill 0.25 pad 0.55)
  Top 0.254: D2.A 43.85,28.67 R26.2
  other vias: 44.5,28.67
N$29
  Bottom 0.254: 39.49,12.18 C11.2 40.22,12.71 U2.4
N$30
  Bottom 0.254: R12.1 40.72,11.9 U2.3
N$31
  Bottom 0.254: R11.1 41.22,12.69 U2.2
OUT  (via drill 0.35 pad 0.75)
  Top 0.254: v44.29,21.43 R30.1
  Top 0.305: v13.17,21.61 15.24,19.54 30,19.54 32.17,21.71 44.13,21.71 R30.1 44.45,21.71 44.95,21.71 51.49,28.25 JP4.1
  Bottom 0.254: U3.7 44.13,21.59 v44.29,21.43 R27.2
  Bottom 0.305: U1.24 13.17,21.29 v13.17,21.61 | R26.1 42.8,28.01 43.34,27.48 50.18,27.48 JP4.1
REF  (via drill 0.3 pad 0.6)
  Top 0.254: JP3.1 46.77,6.76 40.64,6.76 36.18,11.22 v36.18,11.61 42.4,11.61 44.41,9.6 48.32,9.6 49.71,10.99 49.71,12.83 49.25,13.29 J1.2
  Top 0.406: JP3.1 J3.1
  Bottom 0.406: JP3.1 48.88,4.65
  Bottom 0.61: R13.2 v36.18,11.61
SDN  (via drill 0.25 pad 0.55)
  Top 0.152: 40.72,18.07 v40.64,18.07 39.37,18.07 38.87,17.57 38.87,13.95 38.4,13.48 36.24,13.48 34.58,11.82 32.9,11.82 31.68,13.03 25.37,13.03 23.57,14.83 v21.67,14.83
  Bottom 0.152: v21.67,14.83 20.9,14.83 U1.48
  Bottom 0.203: v40.64,18.07 40.64,17.75 40.73,17.66 U2.13
  Bottom 0.254: U2.13 | R31.2 22.6,14.83 v21.67,14.83
USART1_RX
  Bottom 0.203: P2.PAD_PD2 17.81,25.37 U1.32
USART1_TX  (via drill 0.25 pad 0.55)
  Top 0.203: v19.94,28.33 20.77,28.33 P2.PAD_PU2
  Bottom 0.203: v19.94,28.33 19.94,28.09 17.43,25.57 17.43,23.08 16.31,21.97 U1.29
USART2_RX
  Bottom 0.203: P2.PAD_PD4 12.7,9.78 12.7,15.1 13.38,15.78 U1.14
USART2_TX  (via drill 0.25 pad 0.55)
  Top 0.203: v10.06,6.31 9.23,6.31 P2.PAD_PU4
  Bottom 0.203: v10.06,6.31 10.06,6.63 13.13,9.71 13.13,13.86 13.68,14.41 U1.13
USART3_RX
  Bottom 0.203: P2.PAD_PD1 12.46,25.1 12.46,21.25 13.42,20.29 U1.23
USART3_TX  (via drill 0.25 pad 0.55)
  Top 0.203: v9.2,27.54 9.2,28.36 P2.PAD_PU1
  Bottom 0.203: U1.22 13.42,19.79 12.1,21.1 12.1,24.63 v9.2,27.54
USART4_RX
  Bottom 0.203: U1.12 14.31,14.42 13.57,13.67 13.57,9.78 18.42,4.93 P2.PAD_PD3
USART4_TX  (via drill 0.25 pad 0.55)
  Top 0.203: P2.PAD_PU3 20.07,4.93 v19.49,5.51
  Bottom 0.203: v19.49,5.51 19.33,5.67 18.18,5.67 13.93,9.93 13.93,13.51 14.81,14.39 U1.11
USART5_RX
  Bottom 0.203: U1.20 11.52,18.79 11.36,18.95 2.32,18.95 P2.PAD_PD5
USART5_TX  (via drill 0.25 pad 0.55)
  Top 0.203: v3.09,18.27 1.64,18.27 P2.PAD_PU5
  Bottom 0.203: U1.19 11.36,18.28 11.13,18.51 3.33,18.51 v3.09,18.27
VDD  (via drill 0.25 pad 0.55, 0.35 pad 0.75)
  Top 0.152: v55.49,18.9 55.49,18.94
  Top 0.508: FB1.2 18.32,13.19 D3.2 17.79,13.5 17.14,14.14
  Top 0.61: P2.PAD_PU13 30.94,25.94 44.62,33.84 P2.PAD_PU14 45.38,33.84 58.8,26.09 P2.PAD_PU15 | P2.PAD_PU17 44.62,0.8 30.94,8.7 P2.PAD_PU18
  Top 0.813: P2.PAD_PU13 24.08,25.07 24.05,25.1 | P2.PAD_PU18 26.32,9.57 25.87,10.02 | P2.PAD_PU19 14.92,0.88 14.92,4.86 | P2.PAD_PU20 2.13,10.49 3.81,10.49 | P2.PAD_PU11 1.73,24.54 3.97,24.54 | P2.PAD_PU12 15,31.37 | P2.PAD_PU16 59.31,9.74 v58.4,10.65 | P2.PAD_PU15 58.98,25.58 55.49,22.09 55.49,18.94 55.47,18.92
  Bottom 0.813: v58.4,10.65 58.4,13.85 55.49,16.76 v55.49,18.9
  other vias: 23.33,16.86
  pour Top (rank 2): 30.08,7.87 30.08,35.18 13.81,35.18 -0.08,35.18 -0.08,4.62 -0.08,-0.06 27.3,-0.06 30.08,-0.06
VDDA  (via drill 0.25 pad 0.55, 0.35 pad 0.75)
  Top 0.305: FB1.1 21.27,13.25 v21.27,13.43
  Top 0.406: v43.18,20.26 43.34,20.42 46.35,20.42 47.7,19.07 47.7,12.88 v45.16,10.34 44.37,10.34 42.38,12.32 35.74,12.32 34.45,11.02 v34.45,10.21 33.55,10.21 31.15,12.6 23.28,12.6 22.69,13.19 FB1.1
  Bottom 0.254: U1.6 U1.5 U1.4 18.31,13.82 C3.1 C1.1 20.9,13.33 C2.1 v21.27,13.43 C4.1 | U2.17 42.68,15.67 43.53,15.67 43.53,16.68 | 43.53,16.68 43.53,17.13 41.75,17.13 | U2.15 41.75,17.13 | R10.2 34.53,10.21 v34.45,10.21 | R9.2 45,10.49 v45.16,10.34 | U3.8 43.19,20.86 C15.1 C5.1 43.19,19.26 41.75,17.82 41.75,17.13 | C8.1 43.82,16.76 | 43.53,16.68 43.67,16.68 43.82,16.84 43.82,16.76 | R4.2 43.82,16.27 43.82,16.76
  Bottom 0.406: C5.1 43.18,19.4 v43.18,20.26
VSSA  (via drill 0.35 pad 0.75)
  Top 0.305: R2.1 21.33,11.55 v21.35,11.53
  Bottom 0.254: U1.7 16.81,14.24 17.43,13.62 17.55,13.62 17.78,13.39 17.78,12 18.15,11.63 C3.2 C1.2 19.87,11.53 C2.2 v21.35,11.53 C4.2 | C5.2 C15.2 | U2.16 41.22,16.18 | 41.22,16.18 40.72,16.18 U2.21 | U2.14 41.22,16.18
  Bottom 0.813: C4.2 SH1.7
  other vias: 42.7,6.05 41.75,16.13 41.91,20.26 41.67,23.04 45.72,25.58 48.97,24.46 48.5,18.35 49.05,12.56 50.96,12.48 46.35,10.26 39.84,9.22 36.03,9.22 32.38,10.34 32.86,13.03 32.7,18.59 32.7,16.37 32.7,24.46 32.7,22.88 33.73,25.58 36.03,25.58 42.38,25.5 39.61,25.5 47.38,25.65 49.05,23.19 48.5,16.13 51.51,11.13 42.23,9.38 32.94,9.06 52.54,24.23 52.46,21.05 52.07,15.42 55.48,10.1 45,4.22 37.86,6.45 37.7,27.64 40.64,29.23 41.99,18.99 41.59,14.94
  pour Bottom (no thermals): 32.07,34.62 32.07,0.02 60.16,0.02 60.16,34.62
  pour Top (no thermals): 32.07,34.62 32.07,0.02 60.16,0.02 60.16,34.62
  pour Top (no thermals): 20.95,12.16 20.95,12.16 20.95,11.21

### Text on the board
tPlace: 3V3 | 3V3 | P2* | P1 | 3V3 | 3V3 | 3V3 | B | EMG | P5 | C | D | ECG/EOG/EEG | R | IN+ | IN- | 3V3 | 3V3 | Ref | 3V3 | P4* | P3 | 3V3 | 3V3
bPlace: H2BR01-6 | *
tNames: GND | OUT
bNames: GND | GND | P2* | P1 | GND | GND | GND | P5 | GND | GND | GND | P4* | P3 | GND | GND